# Altium schematic sheet 0187_Memory OC Voltage.SchDoc
size 848 x 558 mm
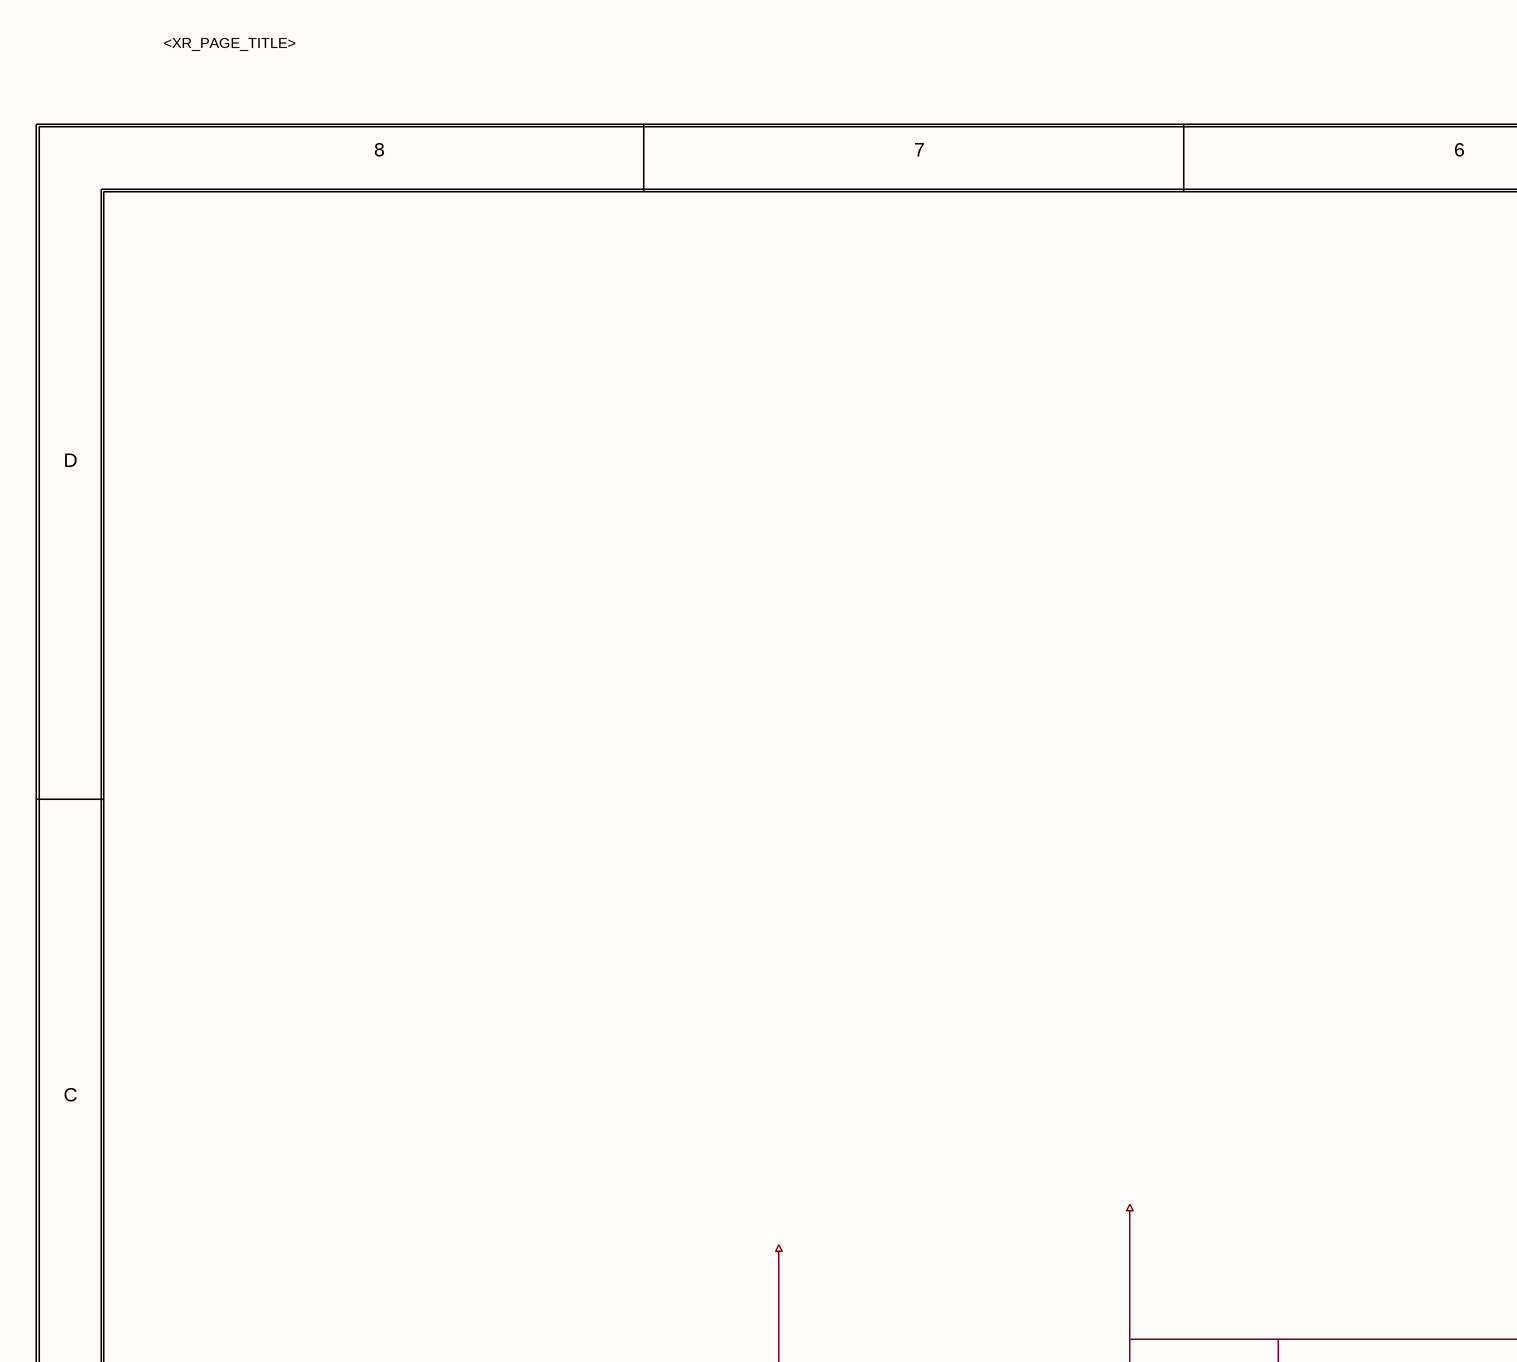
[diagram p0: 0187_Memory OC Voltage.SchDoc, top left]
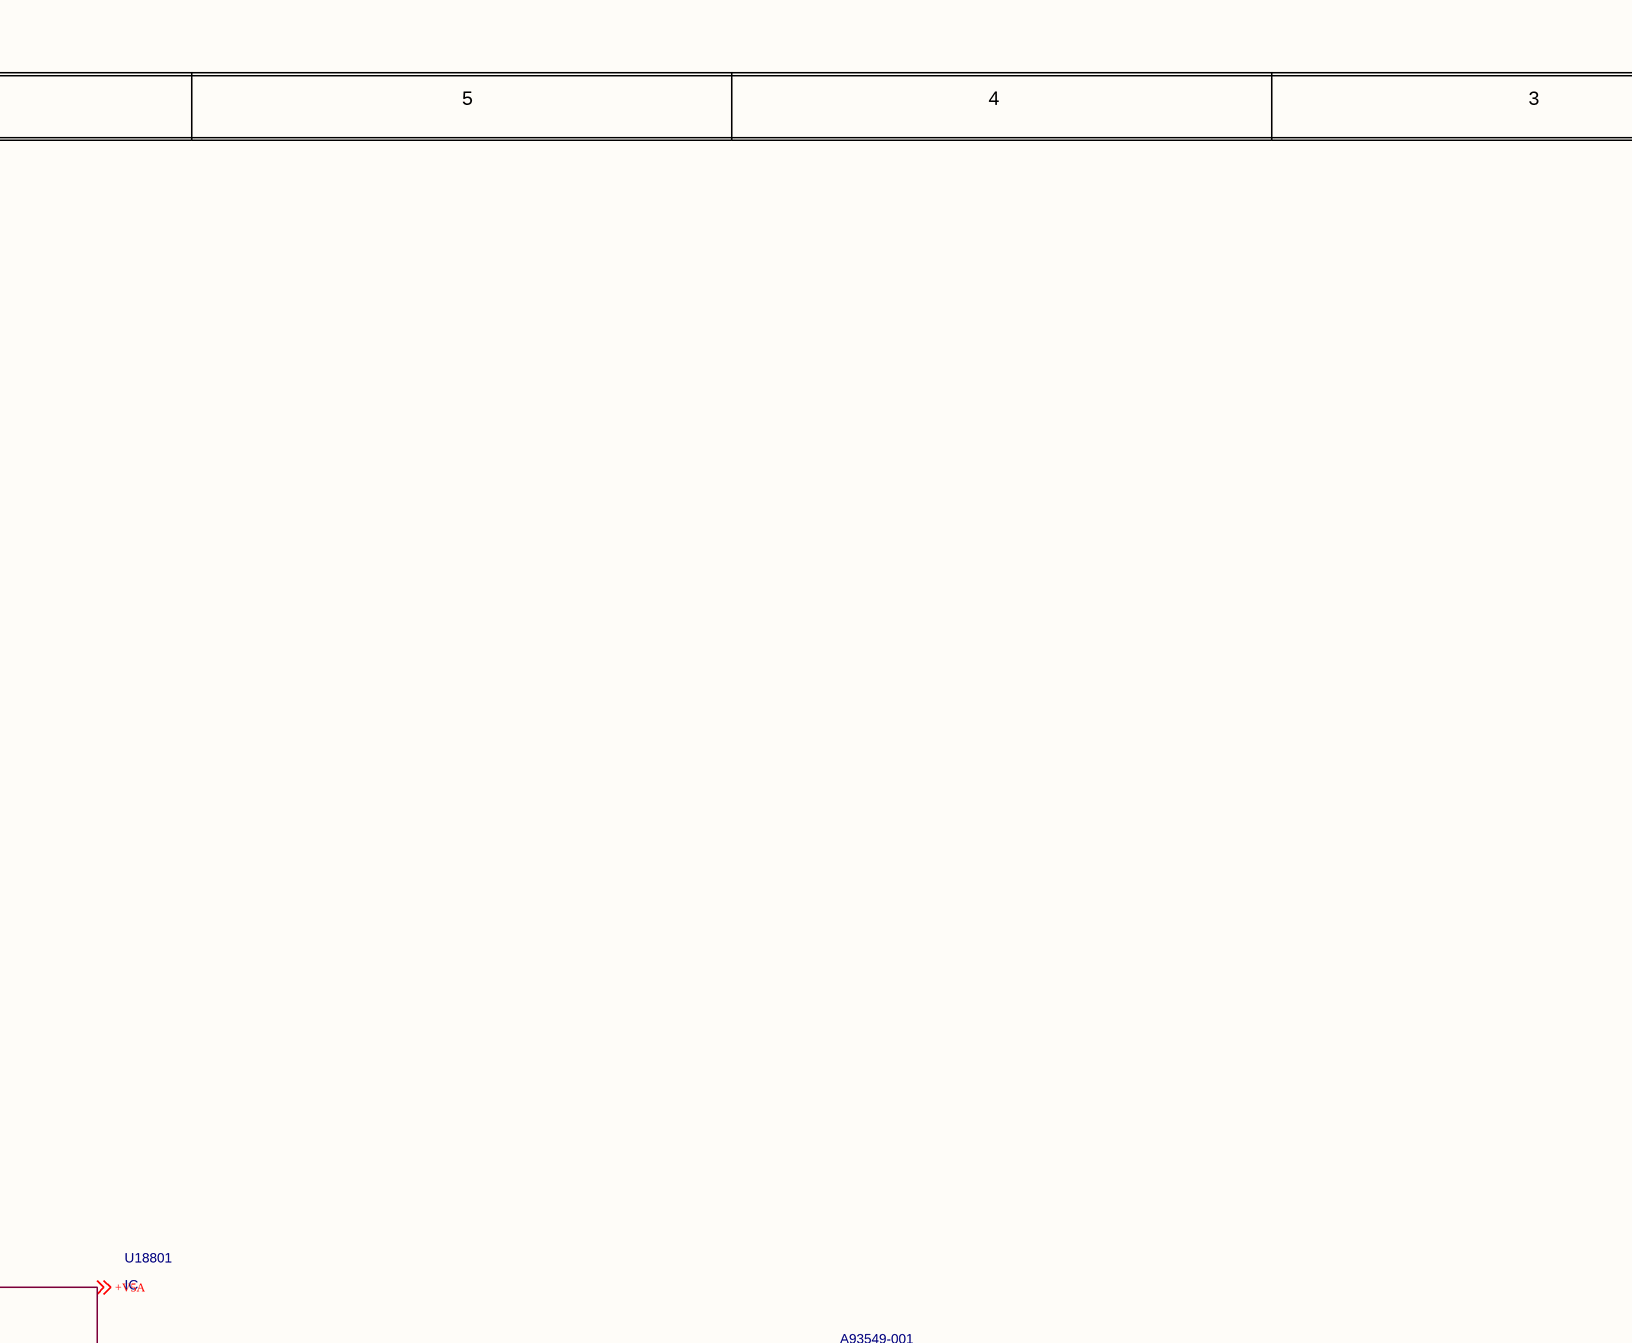
[diagram p1: 0187_Memory OC Voltage.SchDoc, top middle]
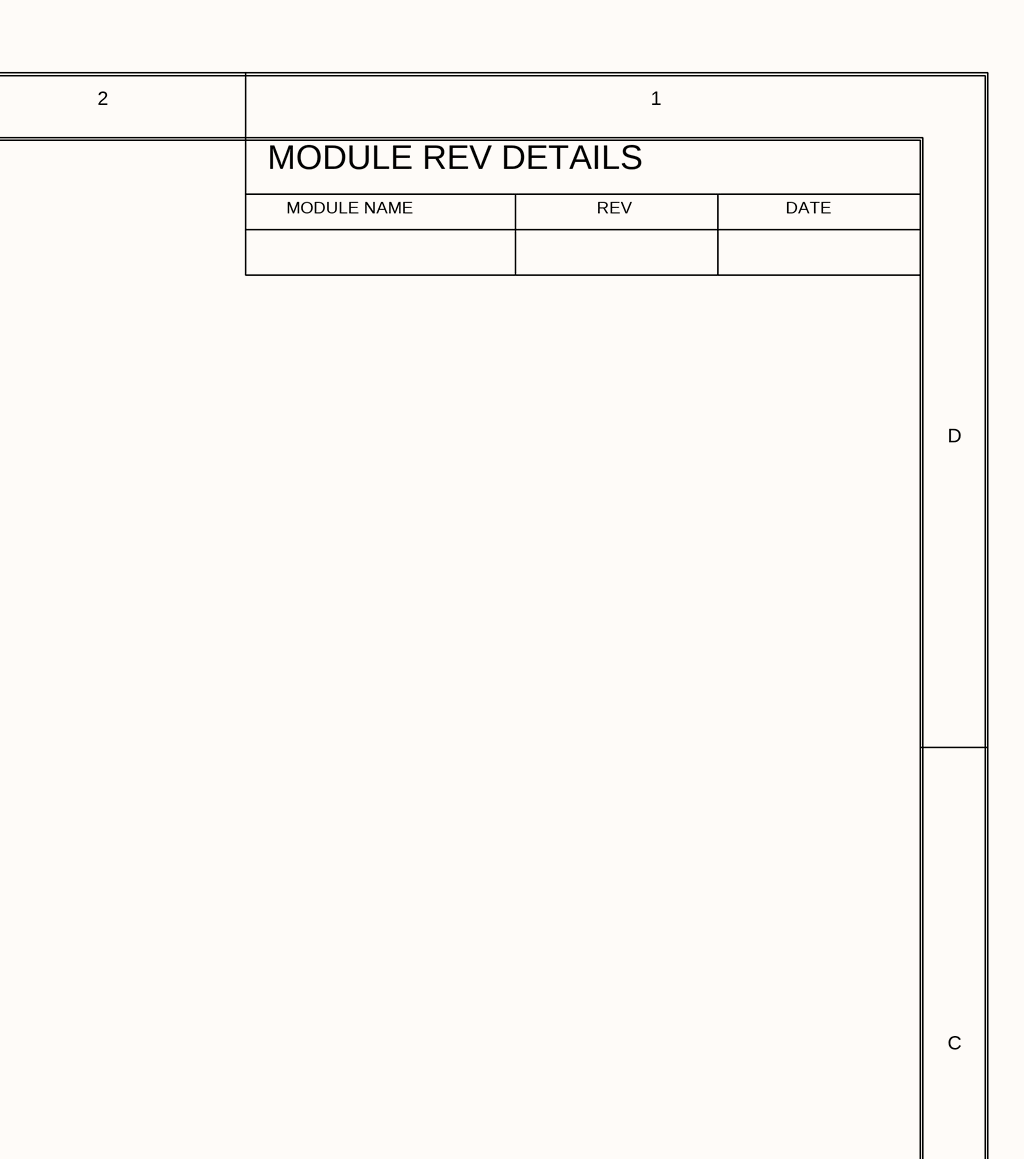
[diagram p2: 0187_Memory OC Voltage.SchDoc, top right]
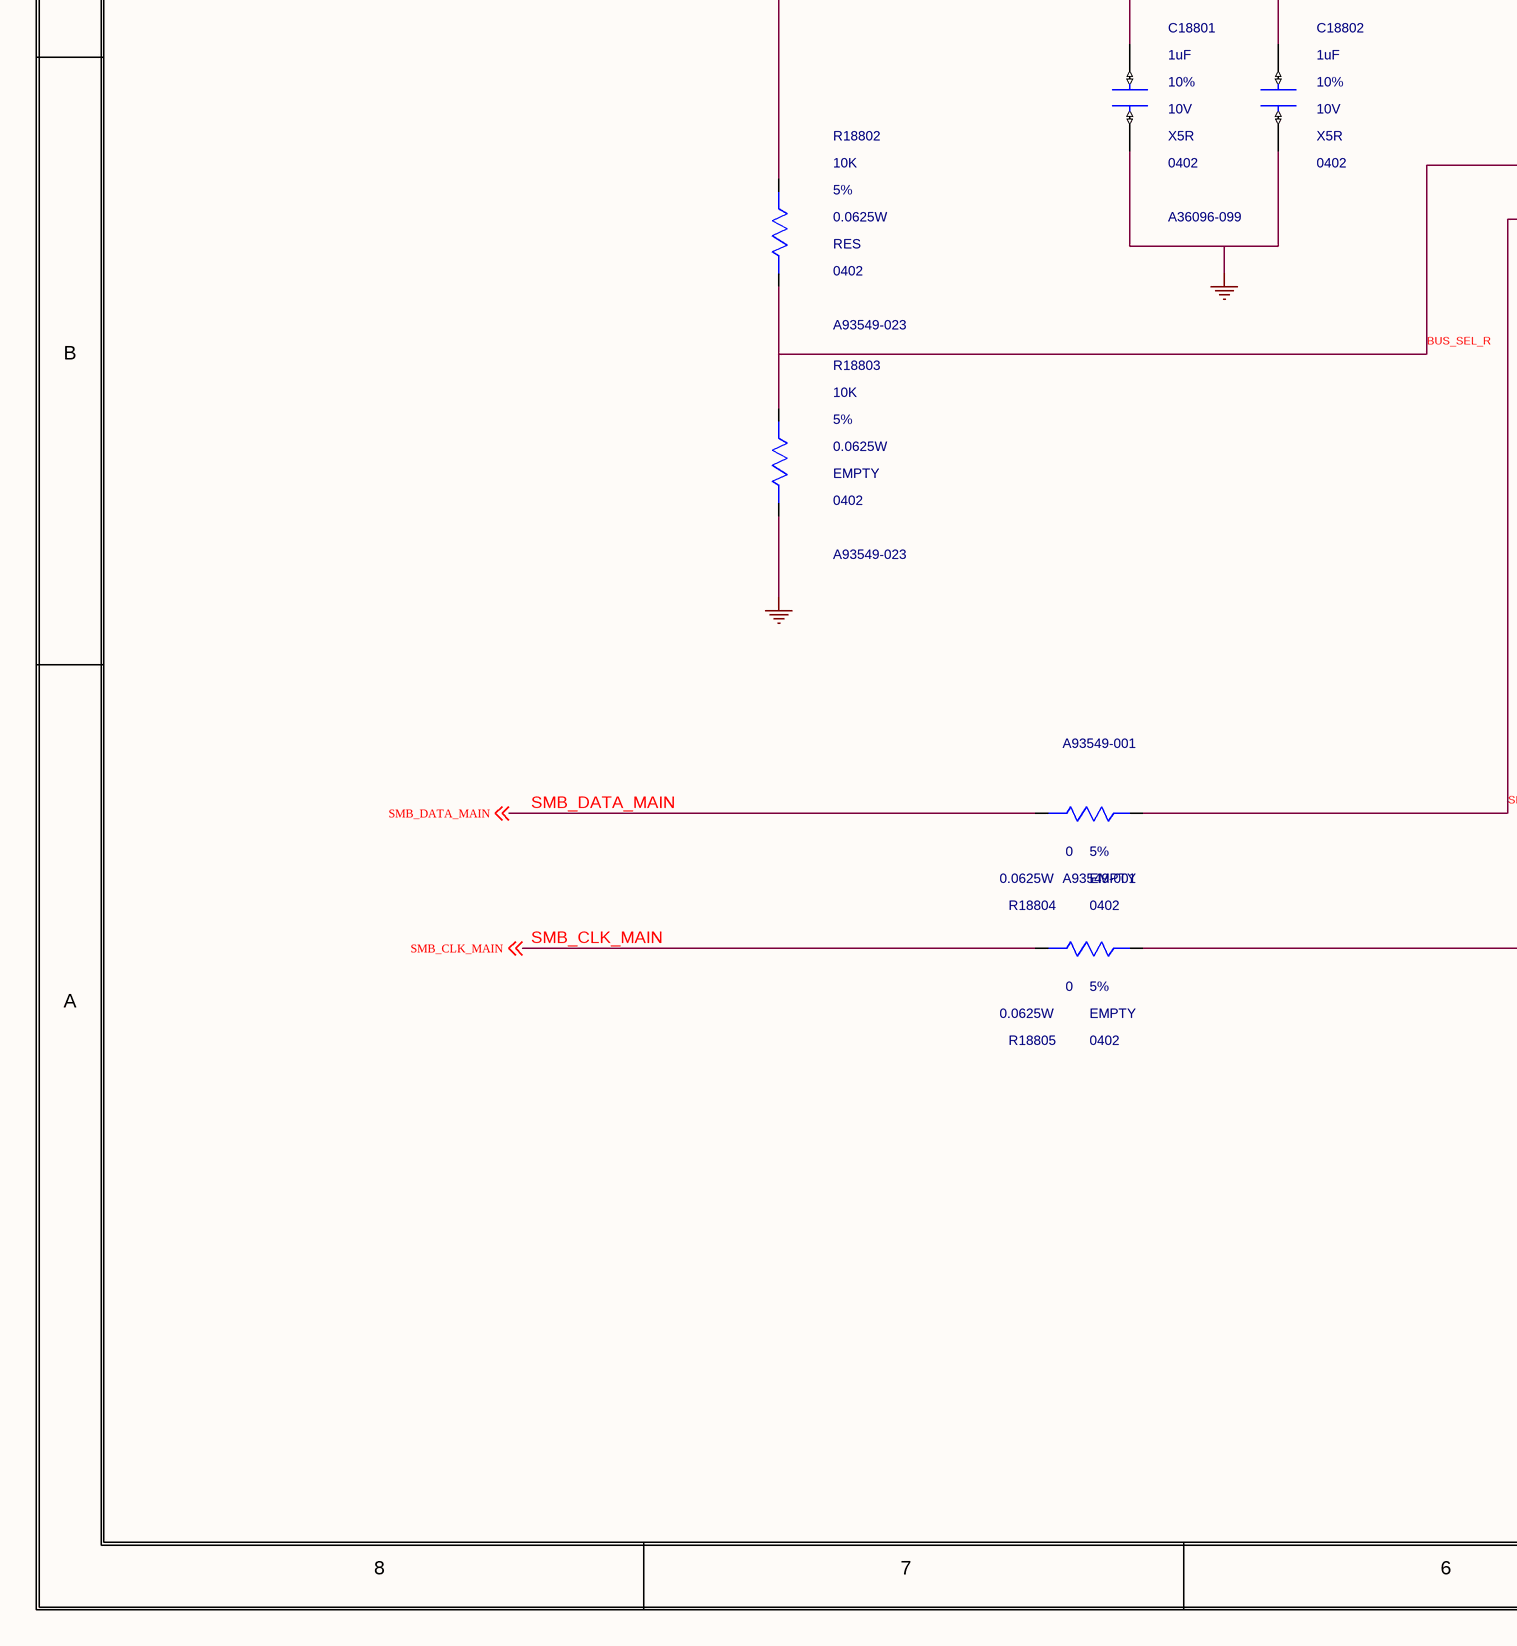
[diagram p3: 0187_Memory OC Voltage.SchDoc, bottom left]
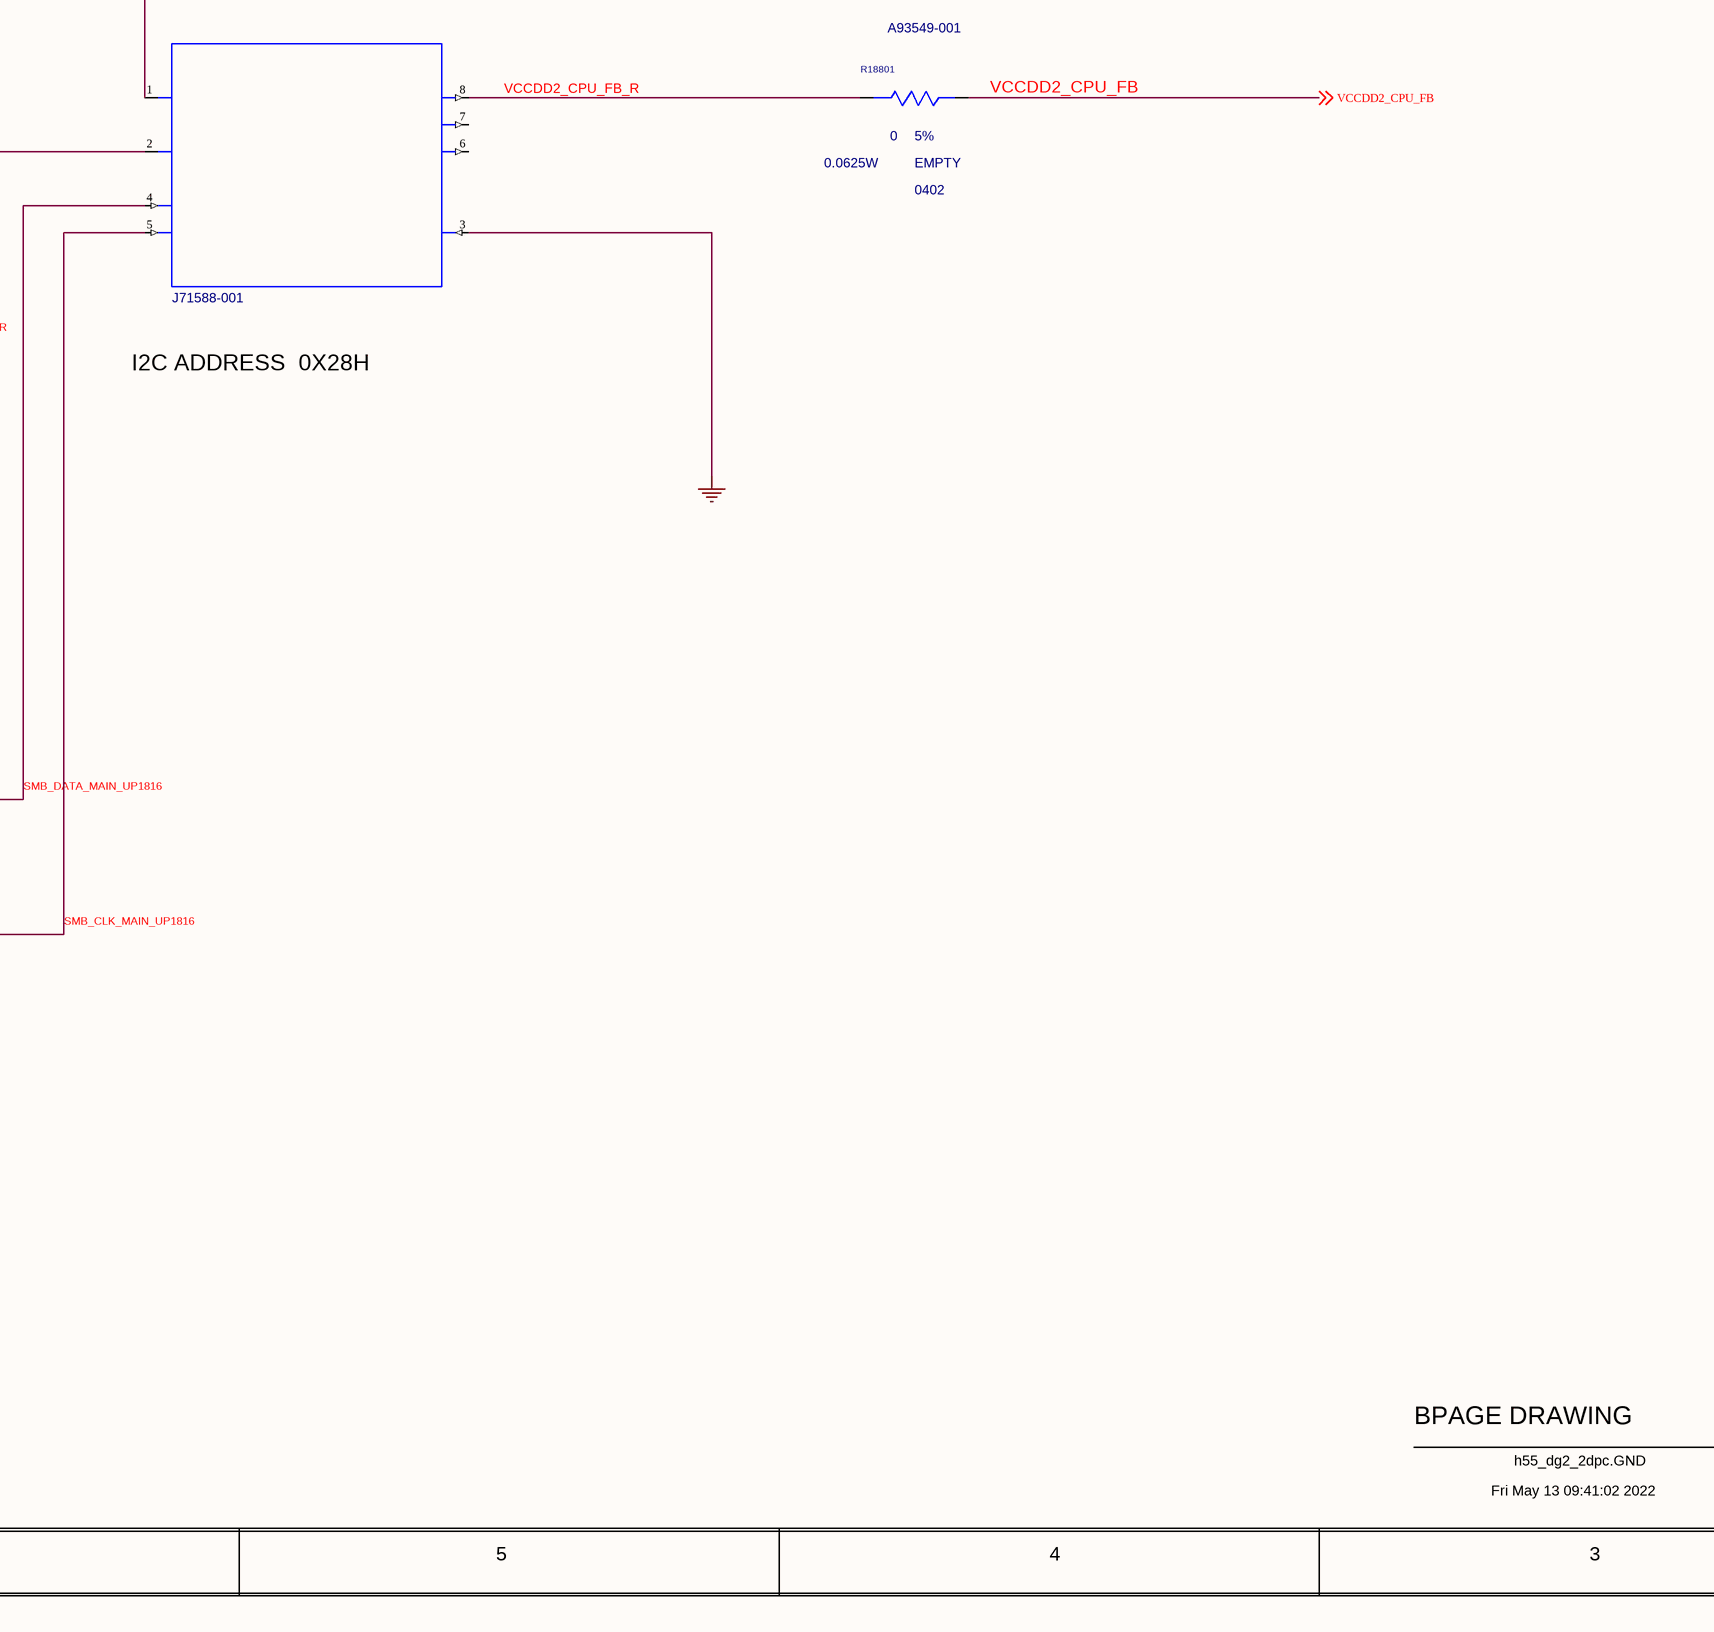
[diagram p4: 0187_Memory OC Voltage.SchDoc, bottom middle]
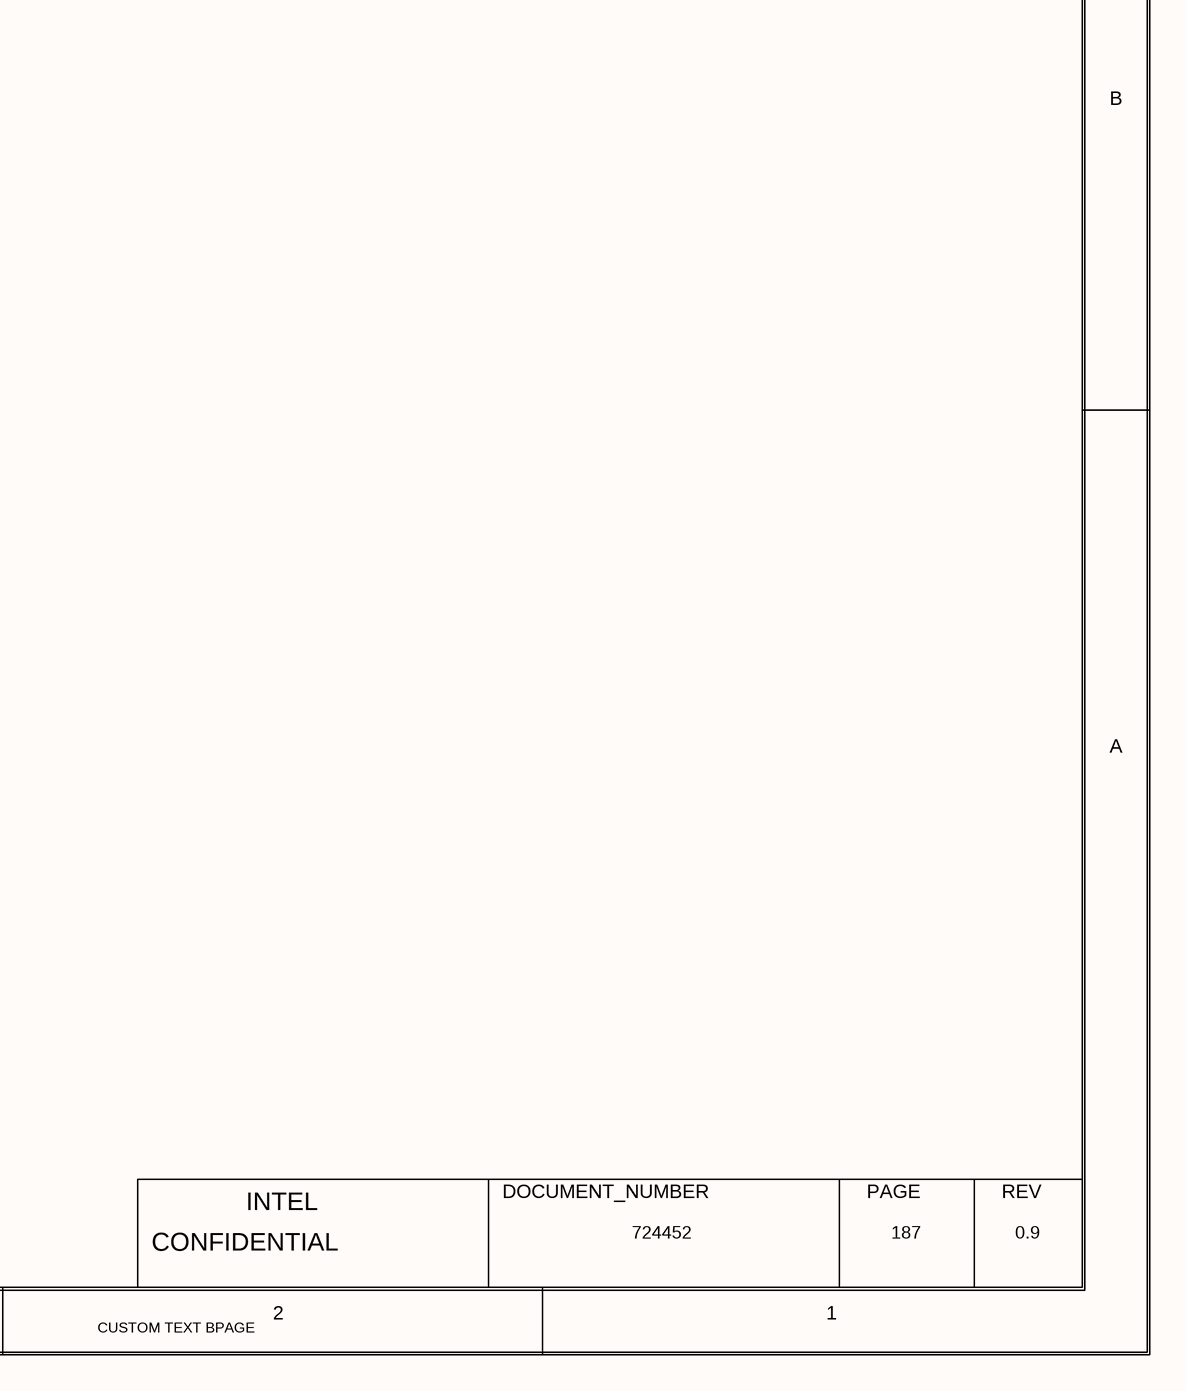
[diagram p5: 0187_Memory OC Voltage.SchDoc, bottom right]

## Parts
C18801  1uF  MATERIAL: X5R  PACK_TYPE: 0402  PART_NUMBER: A36096-099  TOLERANCE: 10%  VOLTAGE: 10V  [CTK2_SM0402_1050X550_MA]
C18802  1uF  MATERIAL: X5R  PACK_TYPE: 0402  TOLERANCE: 10%  VOLTAGE: 10V  [CTK2_SM0402_1050X550_MA]
R18801  0  MATERIAL: EMPTY  PACK_TYPE: 0402  PART_NUMBER: A93549-001  TOLERANCE: 5%  WATTAGE: 0.0625W  [CTK0_SM0402_1100X550_MA]
R18802  10K  MATERIAL: RES  PACK_TYPE: 0402  PART_NUMBER: A93549-023  TOLERANCE: 5%  WATTAGE: 0.0625W  [CTK2_SM0402_1100X550_MA]
R18803  10K  MATERIAL: EMPTY  PACK_TYPE: 0402  PART_NUMBER: A93549-023  TOLERANCE: 5%  WATTAGE: 0.0625W  [CTK2_SM0402_1100X550_MA]
R18804  0  MATERIAL: EMPTY  PACK_TYPE: 0402  PART_NUMBER: A93549-001  TOLERANCE: 5%  WATTAGE: 0.0625W  [CTK2_SM0402_1100X550_MA]
R18805  0  MATERIAL: EMPTY  PACK_TYPE: 0402  PART_NUMBER: A93549-001  TOLERANCE: 5%  WATTAGE: 0.0625W  [CTK2_SM0402_1100X550_MA]
U18801  MATERIAL: IC  PART_NUMBER: J71588-001  [CTK2_SOT23_8_1700X3000_650_MA]  (hidden comment: C_UP1816P)

## Nets
+V5A: C18801.1(A) C18802.1(A) R18802.1(A) U18801.1(VCC) ; off-sheet +V5A
GND: C18801.2(B) C18802.2(B) R18803.2(B) U18801.3(GND)
BUS_SEL_R: R18802.2(B) R18803.1(A) U18801.2(BUS_SEL)
SMB_CLK_MAIN: R18805.1(A) ; off-sheet SMB_CLK_MAIN
SMB_CLK_MAIN_UP1816: R18805.2(B) U18801.5(SCL)
SMB_DATA_MAIN: R18804.1(A) ; off-sheet SMB_DATA_MAIN
SMB_DATA_MAIN_UP1816: R18804.2(B) U18801.4(SDA)
VCCDD2_CPU_FB: R18801.2(B) ; off-sheet VCCDD2_CPU_FB
VCCDD2_CPU_FB_R: R18801.1(A) U18801.8(OUT1)

Not connected (* = marked no-connect by the designer): U18801 6(OUT3) 7(OUT2)

## Notes on the sheet
- <XR_PAGE_TITLE>
- 8
- 7
- 6
- 5
- 4
- 3
- 2
- 1
- MODULE REV DETAILS
- MODULE NAME
- REV
- DATE
- D
- C
- B
- I2C ADDRESS  0X28H
- A
- BPAGE DRAWING
- INTEL
- DOCUMENT_NUMBER
- PAGE
- Fri May 13 09:41:02 2022
- h55_dg2_2dpc.GND
- CONFIDENTIAL
- 724452
- 187
- 0.9
- CUSTOM TEXT BPAGE

## Library data of the parts
C18801 = C_CAP: CDS_PHYS_PART_NAME: C_CAP_0402-A36096-099,X5R,1UF,10V,10%,TK2,GENERIC; CDS_LMAN_SYM_OUTLINE: -50,50,50,-50; FP_TECH: TK2; IP: GENERIC; ROOM: NONE; OriginalSymbolOrigin: (-50,25); XY: (0,1775); VER: 1; ROT: 0; PHYS_PAGE: 187; LOCATION: C18801; DRAWING: @RVP1_ADL_SB_ADP_S_DDR5_SODIMM_2DPC_LIB.H55_DG2_2DPC(SCH_1):PAGE556; CDS_LIB: c_discrete; VARIANT: ?; PCB Footprint: CTK2_SM0402_1050X550_MA; CHIPS_PART_NAME: C_CAP; CDS_PART_NAME: C_CAP_0402-A36096-099,X5R,1UF,10V,10%,TK2,GENERIC; CDS_LOCATION: C18801
C18802 = C_CAP: PART_NUMBER: A36096-099; CDS_PHYS_PART_NAME: C_CAP_0402-A36096-099,X5R,1UF,10V,10%,TK2,GENERIC; CDS_LMAN_SYM_OUTLINE: -50,50,50,-50; FP_TECH: TK2; IP: GENERIC; ROOM: NONE; OriginalSymbolOrigin: (-50,25); XY: (275,1775); VER: 1; ROT: 0; PHYS_PAGE: 187; LOCATION: C18802; DRAWING: @RVP1_ADL_SB_ADP_S_DDR5_SODIMM_2DPC_LIB.H55_DG2_2DPC(SCH_1):PAGE556; CDS_LIB: c_discrete; VARIANT: ?; PCB Footprint: CTK2_SM0402_1050X550_MA; CHIPS_PART_NAME: C_CAP; CDS_PART_NAME: C_CAP_0402-A36096-099,X5R,1UF,10V,10%,TK2,GENERIC; CDS_LOCATION: C18802
R18801 = C_RES#1: CHIPS_PART_NAME: C_RES; CDS_PHYS_PART_NAME: C_RES_0402-A93549-001,EMPTY,0,5%,0.0625W,TK0,GENERIC; CDS_LMAN_SYM_OUTLINE: -50,50,50,-50; FP_TECH: TK0; IP: GENERIC; ROOM: NONE; OriginalSymbolOrigin: (-75,25); XY: (2350,1750); VER: 1; PHYS_PAGE: 187; LOCATION: R18801; DRAWING: @RVP1_ADL_SB_ADP_S_DDR5_SODIMM_2DPC_LIB.H55_DG2_2DPC(SCH_1):PAGE556; CDS_LIB: c_discrete; VARIANT: ?; PCB Footprint: CTK0_SM0402_1100X550_MA; SEC_TYPE: 0402; ROT: 0; CDS_PART_NAME: C_RES_0402-A93549-001,EMPTY,0,5%,0.0625W,TK0,GENERIC; CDS_LOCATION: R18801
R18802 = C_RES: CDS_PHYS_PART_NAME: C_RES_0402-A93549-023,RES,10K,5%,0.0625W,TK2,GENERIC; CDS_LMAN_SYM_OUTLINE: -50,50,50,-50; FP_TECH: TK2; IP: GENERIC; ROOM: NONE; OriginalSymbolOrigin: (-25,75); XY: (-650,1525); VER: 2; ROT: 0; PHYS_PAGE: 187; LOCATION: R18802; DRAWING: @RVP1_ADL_SB_ADP_S_DDR5_SODIMM_2DPC_LIB.H55_DG2_2DPC(SCH_1):PAGE556; CDS_LIB: c_discrete; VARIANT: ?; PCB Footprint: CTK2_SM0402_1100X550_MA; CHIPS_PART_NAME: C_RES; CDS_PART_NAME: C_RES_0402-A93549-023,RES,10K,5%,0.0625W,TK2,GENERIC; CDS_LOCATION: R18802
R18803 = C_RES: CDS_PHYS_PART_NAME: C_RES_0402-A93549-023,EMPTY,10K,5%,0.0625W,TK2,GENERIC; CDS_LMAN_SYM_OUTLINE: -50,50,50,-50; FP_TECH: TK2; IP: GENERIC; ROOM: NONE; OriginalSymbolOrigin: (-25,75); XY: (-650,1100); VER: 2; ROT: 0; PHYS_PAGE: 187; LOCATION: R18803; DRAWING: @RVP1_ADL_SB_ADP_S_DDR5_SODIMM_2DPC_LIB.H55_DG2_2DPC(SCH_1):PAGE556; CDS_LIB: c_discrete; VARIANT: ?; PCB Footprint: CTK2_SM0402_1100X550_MA; CHIPS_PART_NAME: C_RES; CDS_PART_NAME: C_RES_0402-A93549-023,EMPTY,10K,5%,0.0625W,TK2,GENERIC; CDS_LOCATION: R18803
R18804 = C_RES#1: CHIPS_PART_NAME: C_RES; CDS_PHYS_PART_NAME: C_RES_0402-A93549-001,EMPTY,0,5%,0.0625W,TK2,GENERIC; CDS_LMAN_SYM_OUTLINE: -50,50,50,-50; FP_TECH: TK2; IP: GENERIC; ROOM: NONE; OriginalSymbolOrigin: (-75,25); XY: (-75,450); VER: 1; PHYS_PAGE: 187; LOCATION: R18804; DRAWING: @RVP1_ADL_SB_ADP_S_DDR5_SODIMM_2DPC_LIB.H55_DG2_2DPC(SCH_1):PAGE556; CDS_LIB: c_discrete; VARIANT: ?; PCB Footprint: CTK2_SM0402_1100X550_MA; ROT: 0; CDS_PART_NAME: C_RES_0402-A93549-001,EMPTY,0,5%,0.0625W,TK2,GENERIC; CDS_LOCATION: R18804
R18805 = C_RES#1: CHIPS_PART_NAME: C_RES; CDS_PHYS_PART_NAME: C_RES_0402-A93549-001,EMPTY,0,5%,0.0625W,TK2,GENERIC; CDS_LMAN_SYM_OUTLINE: -50,50,50,-50; FP_TECH: TK2; IP: GENERIC; ROOM: NONE; OriginalSymbolOrigin: (-75,25); XY: (-75,200); VER: 1; PHYS_PAGE: 187; LOCATION: R18805; DRAWING: @RVP1_ADL_SB_ADP_S_DDR5_SODIMM_2DPC_LIB.H55_DG2_2DPC(SCH_1):PAGE556; CDS_LIB: c_discrete; VARIANT: ?; PCB Footprint: CTK2_SM0402_1100X550_MA; ROT: 0; CDS_PART_NAME: C_RES_0402-A93549-001,EMPTY,0,5%,0.0625W,TK2,GENERIC; CDS_LOCATION: R18805
U18801 = C_UP1816P: CDS_PHYS_PART_NAME: C_UP1816P_SOT23-J71588-001,IC,UP1816PMA8,TK2,GENERIC; CDS_LMAN_SYM_OUTLINE: -250,200,250,-250; FP_TECH: TK2; IP: GENERIC; PACK_TYPE: SOT23; ROOM: NONE; OriginalSymbolOrigin: (-275,200); XY: (1225,1650); VER: 1; ROT: 0; PHYS_PAGE: 187; LOCATION: U18801; DRAWING: @RVP1_ADL_SB_ADP_S_DDR5_SODIMM_2DPC_LIB.H55_DG2_2DPC(SCH_1):PAGE556; CDS_LIB: local; VARIANT: ?; PCB Footprint: CTK2_SOT23_8_1700X3000_650_MA; CHIPS_PART_NAME: C_UP1816P; CDS_PART_NAME: C_UP1816P_SOT23-J71588-001,IC,UP1816PMA8,TK2,GENERIC; CDS_LOCATION: U18801